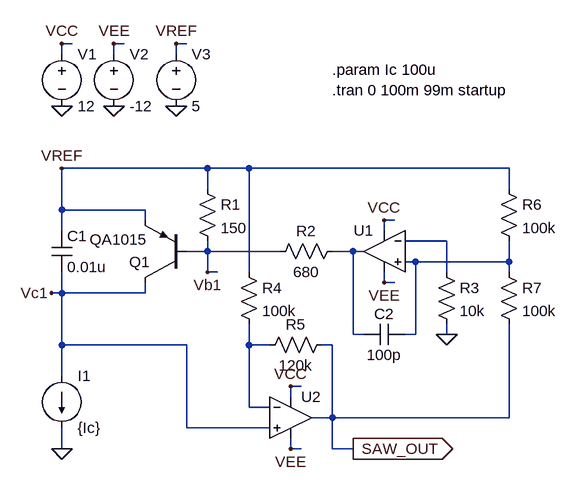
[diagram p0: schematic VCO_Sawtooth_2.asc]
VCO_Sawtooth_2.asc, the LTspice schematic file:
Version 4
SHEET 1 1004 680
WIRE 128 -208 112 -208
WIRE 208 -208 192 -208
WIRE 304 -208 288 -208
WIRE 112 -192 112 -208
WIRE 192 -192 192 -208
WIRE 288 -192 288 -208
WIRE 336 -16 112 -16
WIRE 400 -16 336 -16
WIRE 800 -16 400 -16
WIRE 336 16 336 -16
WIRE 800 16 800 -16
WIRE 112 48 112 -16
WIRE 240 48 112 48
WIRE 240 64 240 48
WIRE 624 64 608 64
WIRE 112 80 112 48
WIRE 608 80 608 64
WIRE 704 96 640 96
WIRE 336 112 336 96
WIRE 336 112 304 112
WIRE 448 112 336 112
WIRE 560 112 528 112
WIRE 576 112 560 112
WIRE 656 128 640 128
WIRE 800 128 800 96
WIRE 800 128 656 128
WIRE 336 144 336 112
WIRE 352 144 336 144
WIRE 400 144 400 -16
WIRE 704 144 704 96
WIRE 800 144 800 128
WIRE 608 160 608 144
WIRE 624 160 608 160
WIRE 112 176 112 144
WIRE 112 176 96 176
WIRE 240 176 240 160
WIRE 240 176 112 176
WIRE 560 240 560 112
WIRE 576 240 560 240
WIRE 656 240 656 128
WIRE 656 240 640 240
WIRE 704 240 704 224
WIRE 112 256 112 176
WIRE 304 256 112 256
WIRE 400 256 400 224
WIRE 432 256 400 256
WIRE 528 256 512 256
WIRE 112 304 112 256
WIRE 480 320 464 320
WIRE 464 336 464 320
WIRE 400 352 400 256
WIRE 432 352 400 352
WIRE 528 368 528 256
WIRE 528 368 496 368
WIRE 800 368 800 224
WIRE 800 368 528 368
WIRE 304 384 304 256
WIRE 432 384 304 384
WIRE 112 416 112 384
WIRE 464 416 464 400
WIRE 480 416 464 416
WIRE 528 416 528 368
WIRE 560 416 528 416
FLAG 112 416 0
FLAG 608 64 VCC
FLAG 608 160 VEE
FLAG 704 240 0
FLAG 464 320 VCC
FLAG 464 416 VEE
FLAG 112 -16 VREF
FLAG 112 -112 0
FLAG 192 -112 0
FLAG 288 -112 0
FLAG 112 -208 VCC
FLAG 192 -208 VEE
FLAG 288 -208 VREF
FLAG 560 416 SAW_OUT
IOPIN 560 416 Out
FLAG 336 144 Vb1
FLAG 96 176 Vc1
SYMBOL cap 96 80 R0
SYMATTR InstName C1
SYMATTR Value 0.01u
SYMBOL pnp 304 160 R180
WINDOW 3 61 66 Left 2
SYMATTR Value QA1015
SYMATTR InstName Q1
SYMBOL res 320 0 R0
SYMATTR InstName R1
SYMATTR Value 150
SYMBOL current 112 304 R0
WINDOW 123 0 0 Left 2
WINDOW 39 0 0 Left 2
SYMATTR InstName I1
SYMATTR Value {Ic}
SYMBOL res 544 96 R90
WINDOW 0 0 56 VBottom 2
WINDOW 3 32 56 VTop 2
SYMATTR InstName R2
SYMATTR Value 680
SYMBOL Opamps\\UniversalOpamp2 608 112 M0
SYMATTR InstName U1
SYMBOL cap 640 224 R90
WINDOW 0 0 32 VBottom 2
WINDOW 3 32 32 VTop 2
SYMATTR InstName C2
SYMATTR Value 100p
SYMBOL res 688 128 R0
SYMATTR InstName R3
SYMATTR Value 10k
SYMBOL Opamps\\UniversalOpamp2 464 368 R0
SYMATTR InstName U2
SYMBOL res 384 128 R0
SYMATTR InstName R4
SYMATTR Value 100k
SYMBOL res 528 240 R90
WINDOW 0 0 56 VBottom 2
WINDOW 3 32 56 VTop 2
SYMATTR InstName R5
SYMATTR Value 120k
SYMBOL res 784 0 R0
SYMATTR InstName R6
SYMATTR Value 100k
SYMBOL res 784 128 R0
SYMATTR InstName R7
SYMATTR Value 100k
SYMBOL voltage 112 -208 R0
WINDOW 123 0 0 Left 2
WINDOW 39 0 0 Left 2
SYMATTR InstName V1
SYMATTR Value 12
SYMBOL voltage 192 -208 R0
WINDOW 123 0 0 Left 2
WINDOW 39 0 0 Left 2
SYMATTR InstName V2
SYMATTR Value -12
SYMBOL voltage 288 -208 R0
WINDOW 123 0 0 Left 2
WINDOW 39 0 0 Left 2
SYMATTR InstName V3
SYMATTR Value 5
TEXT 528 -168 Left 2 !.param Ic 100u
TEXT 528 -136 Left 2 !.tran 0 100m 99m startup

The netlist it stands for:
* VCO_Sawtooth_2.asc
C1 VREF Vc1 0.01u
Q1 Vc1 Vb1 VREF 0 QA1015
R1 VREF Vb1 150
I1 Vc1 0 {Ic}
R2 N002 Vb1 680
XU1 N003 N001 VCC VEE N002 level.2 Avol=1Meg GBW=10Meg Slew=10Meg ilimit=25m rail=0 Vos=0 phimargin=45 en=0 enk=0 in=0 ink=0 Rin=500Meg  ; pins IN+ IN- V+ V- OUT
C2 N003 N002 100p
R3 N001 0 10k
XU2 Vc1 N004 VCC VEE SAW_OUT level.2 Avol=1Meg GBW=10Meg Slew=10Meg ilimit=25m rail=0 Vos=0 phimargin=45 en=0 enk=0 in=0 ink=0 Rin=500Meg  ; pins IN+ IN- V+ V- OUT
R4 VREF N004 100k
R5 SAW_OUT N004 120k
R6 VREF N003 100k
R7 N003 SAW_OUT 100k
V1 VCC 0 12
V2 VEE 0 -12
V3 VREF 0 5
.model NPN NPN
.model PNP PNP
.lib standard.bjt
.param Ic 100u
.tran 0 100m 99m startup
.lib UniversalOpamps2.sub
.backanno
.end